# EAGLE design Chasis_2018 (EAGLE 8.5.1)
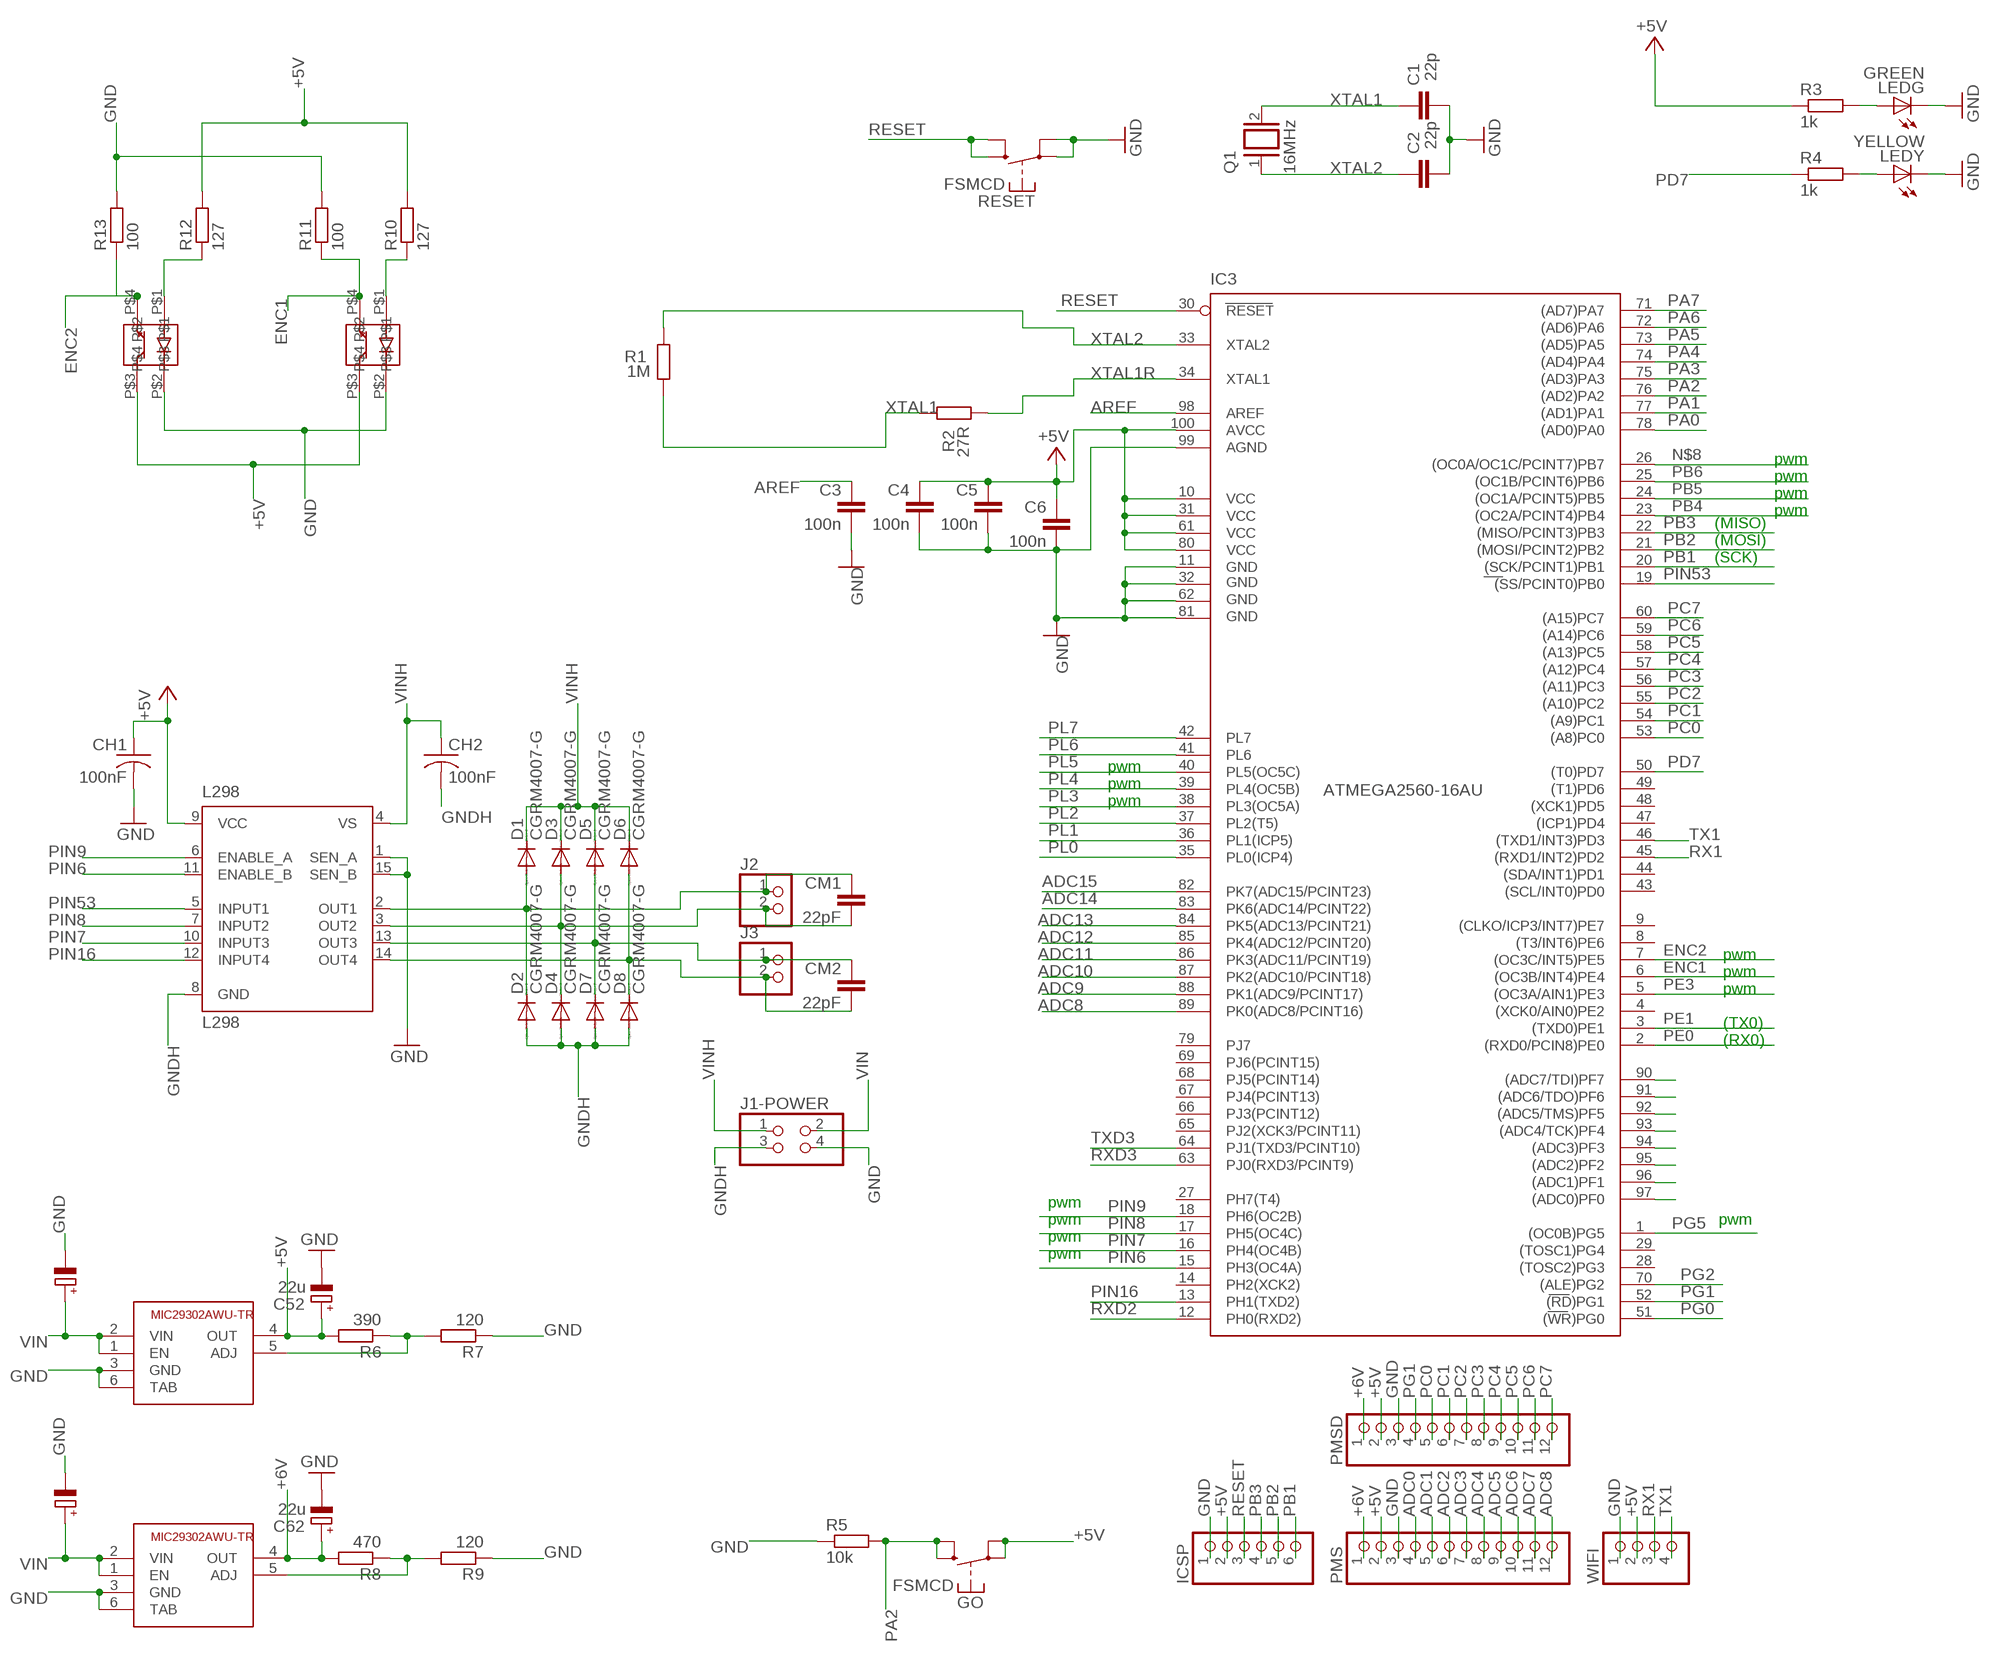
[diagram p0: schematic, sheet 1]

## Parts
C1  22p  C-EUC0805K  [C0805K]
C2  22p  C-EUC0805K  [C0805K]
C3  100n  C-EUC0805K  [C0805K]
C4  100n  C-EUC0805K  [C0805K]
C5  100n  C-EUC0805K  [C0805K]
C6  100n  C-EUC0805K  [C0805K]
C51  10u  CPOL-EUD  [PANASONIC_D]
C52  22u  CPOL-EUD  [PANASONIC_D]
C61  10u  CPOL-EUD  [PANASONIC_D]
C62  22u  CPOL-EUD  [PANASONIC_D]
CH1  100nF  C-USC0805K  [C0805K]
CH2  100nF  C-USC0805K  [C0805K]
CM1  22pF  C-EUC1206K  [C1206K]
CM2  22pF  C-EUC1206K  [C1206K]
D1  CGRM4007-G  [SOD-123_MINI-SMA]
D2  CGRM4007-G  [SOD-123_MINI-SMA]
D3  CGRM4007-G  [SOD-123_MINI-SMA]
D4  CGRM4007-G  [SOD-123_MINI-SMA]
D5  CGRM4007-G  [SOD-123_MINI-SMA]
D6  CGRM4007-G  [SOD-123_MINI-SMA]
D7  CGRM4007-G  [SOD-123_MINI-SMA]
D8  CGRM4007-G  [SOD-123_MINI-SMA]
ENC1  EE-SX1046  [EE-SX1046]
ENC2  EE-SX1046  [EE-SX1046]
GO  FSMCD  [FSMCD]
IC3  ATMEGA2560-16AU  ATMEGA1280-16AU  [TQFP100]
ICSP  PINHD-1X6  [1X06]
J1-POWER  PINHD-2X2  [2X02]
J2  PINHD-1X2  [1X02]
J3  PINHD-1X2  [1X02]
L298  L298  [MULTIWATT-15]
LEDG  GREEN  LEDCHIP-LED0805  [CHIP-LED0805]
LEDY  YELLOW  LEDCHIP-LED0805  [CHIP-LED0805]
PMS  PINHD-1X12  [1X12]
PMSD  PINHD-1X12  [1X12]
Q1  16MHz  XTAL/S  [QS]
R1  1M  R-EU_R0805W  [R0805W]
R2  27R  R-EU_R0805W  [R0805W]
R3  1k  R-EU_R0805W  [R0805W]
R4  1k  R-EU_R0805W  [R0805W]
R5  10k  R-EU_R0805W  [R0805W]
R6  390  R-EU_R0805W  [R0805W]
R7  120  R-EU_R0805W  [R0805W]
R8  470  R-EU_R0805W  [R0805W]
R9  120  R-EU_R0805W  [R0805W]
R10  127  R-EU_R0805W  [R0805W]
R11  100  R-EU_R0805W  [R0805W]
R12  127  R-EU_R0805W  [R0805W]
R13  100  R-EU_R0805W  [R0805W]
REG5V  MIC29302AWU-TR  [TO263-5]
REG6V  MIC29302AWU-TR  [TO263-5]
RESET  FSMCD  [FSMCD]
WIFI  PINHD-1X4  [1X04]

## Nets
+5V: C4.1 C5.1 C6.1 C52.+ CH1.1 ENC1.P$3 ENC2.P$3 GO.P$1(P) GO.P$2(P) IC3.10(VCC) IC3.31(VCC1) IC3.61(VCC2) IC3.80(VCC3) IC3.100(AVCC) ICSP.2 L298.9(VCC) PMS.2 PMSD.2 R3.1 R6.2 R10.2 R12.2 REG5V.4(OUT) WIFI.2
+6V: C62.+ PMS.1 PMSD.1 R8.2 REG6V.4(OUT)
ADC0: IC3.97((ADC0)PF0) PMS.4
ADC1: IC3.96((ADC1)PF1) PMS.5
ADC2: IC3.95((ADC2)PF2) PMS.6
ADC3: IC3.94((ADC3)PF3) PMS.7
ADC4: IC3.93((ADC4/TCK)PF4) PMS.8
ADC5: IC3.92((ADC5/TMS)PF5) PMS.9
ADC6: IC3.91((ADC6/TDO)PF6) PMS.10
ADC7: IC3.90((ADC7/TDI)PF7) PMS.11
ADC8: IC3.89(PK0(ADC8/PCINT16)) PMS.12
ADC9: IC3.88(PK1(ADC9/PCINT17))
ADC10: IC3.87(PK2(ADC10/PCINT18))
ADC11: IC3.86(PK3(ADC11/PCINT19))
ADC12: IC3.85(PK4(ADC12/PCINT20))
ADC13: IC3.84(PK5(ADC13/PCINT21))
ADC14: IC3.83(PK6(ADC14/PCINT22))
ADC15: IC3.82(PK7(ADC15/PCINT23))
AREF: C3.1 IC3.98(AREF)
ENC1: ENC2.P$4 IC3.6((OC3B/INT4)PE4) R11.1
ENC2: ENC1.P$4 IC3.7((OC3C/INT5)PE5) R13.1
GND: C1.1 C2.1 C3.2 C4.2 C5.2 C6.2 C51.- C52.- C61.- C62.- CH1.2 ENC1.P$2 ENC2.P$2 IC3.11(GND) IC3.32(GND1) IC3.62(GND2) IC3.81(GND3) IC3.99(AGND) ICSP.1 J1-POWER.4 L298.1(SEN_A) L298.15(SEN_B) LEDG.C LEDY.C PMS.3 PMSD.3 R5.1 R7.1 R9.1 R11.2 R13.2 REG5V.3(GND) REG5V.6(TAB) REG6V.3(GND) REG6V.6(TAB) RESET.P$1(P) RESET.P$2(P) WIFI.1
GNDH [vcc]: CH2.2 D2.A D4.A D7.A D8.A J1-POWER.3 L298.8(GND)
N$1 [vcc]: CM1.1 D1.A D2.C J2.1 L298.2(OUT1)
N$2: LEDY.A R4.2
N$3: LEDG.A R3.2
N$4 [vcc]: CM1.2 D3.A D4.C J2.2 L298.3(OUT2)
N$5 [vcc]: CM2.2 D6.A D8.C J3.2 L298.14(OUT4)
N$6 [vcc]: CM2.1 D5.A D7.C J3.1 L298.13(OUT3)
N$8: IC3.26((OC0A/OC1C/PCINT7)PB7)
N$9: ENC1.P$1 R12.1
N$11: ENC2.P$1 R10.1
N$12: R6.1 R7.2 REG5V.5(ADJ)
N$17: R8.1 R9.2 REG6V.5(ADJ)
PA0: IC3.78((AD0)PA0)
PA1: IC3.77((AD1)PA1)
PA2: GO.P$3(S) GO.P$4(S) IC3.76((AD2)PA2) R5.2
PA3: IC3.75((AD3)PA3)
PA4: IC3.74((AD4)PA4)
PA5: IC3.73((AD5)PA5)
PA6: IC3.72((AD6)PA6)
PA7: IC3.71((AD7)PA7)
PB1: IC3.20((SCK/PCINT1)PB1) ICSP.6
PB2: IC3.21((MOSI/PCINT2)PB2) ICSP.5
PB3: IC3.22((MISO/PCINT3)PB3) ICSP.4
PB4: IC3.23((OC2A/PCINT4)PB4)
PB5: IC3.24((OC1A/PCINT5)PB5)
PB6: IC3.25((OC1B/PCINT6)PB6)
PC0: IC3.53((A8)PC0) PMSD.5
PC1: IC3.54((A9)PC1) PMSD.6
PC2: IC3.55((A10)PC2) PMSD.7
PC3: IC3.56((A11)PC3) PMSD.8
PC4: IC3.57((A12)PC4) PMSD.9
PC5: IC3.58((A13)PC5) PMSD.10
PC6: IC3.59((A14)PC6) PMSD.11
PC7: IC3.60((A15)PC7) PMSD.12
PD7: IC3.50((T0)PD7) R4.1
PE0: IC3.2((RXD0/PCIN8)PE0)
PE1: IC3.3((TXD0)PE1)
PE3: IC3.5((OC3A/AIN1)PE3)
PG0: IC3.51((WR)PG0)
PG1: IC3.52((RD)PG1) PMSD.4
PG2: IC3.70((ALE)PG2)
PG5: IC3.1((OC0B)PG5)
PIN6: IC3.15(PH3(OC4A)) L298.11(ENABLE_B)
PIN7: IC3.16(PH4(OC4B)) L298.10(INPUT3)
PIN8: IC3.17(PH5(OC4C)) L298.7(INPUT2)
PIN9: IC3.18(PH6(OC2B)) L298.6(ENABLE_A)
PIN16: IC3.13(PH1(TXD2)) L298.12(INPUT4)
PIN53: IC3.19((SS/PCINT0)PB0) L298.5(INPUT1)
PL0: IC3.35(PL0(ICP4))
PL1: IC3.36(PL1(ICP5))
PL2: IC3.37(PL2(T5))
PL3: IC3.38(PL3(OC5A))
PL4: IC3.39(PL4(OC5B))
PL5: IC3.40(PL5(OC5C))
PL6: IC3.41(PL6)
PL7: IC3.42(PL7)
RESET: IC3.30(RESET) ICSP.3 RESET.P$3(S) RESET.P$4(S)
RX1: IC3.45((RXD1/INT2)PD2) WIFI.3
RXD2: IC3.12(PH0(RXD2))
RXD3: IC3.63(PJ0(RXD3/PCINT9))
TX1: IC3.46((TXD1/INT3)PD3) WIFI.4
TXD3: IC3.64(PJ1(TXD3/PCINT10))
VIN: C51.+ C61.+ J1-POWER.2 REG5V.1(EN) REG5V.2(VIN) REG6V.1(EN) REG6V.2(VIN)
VINH [vcc]: CH2.1 D1.C D3.C D5.C D6.C J1-POWER.1 L298.4(VS)
XTAL1: C1.2 Q1.2 R1.1 R2.2
XTAL1R: IC3.34(XTAL1) R2.1
XTAL2: C2.2 IC3.33(XTAL2) Q1.1 R1.2
Unconnected: IC3.4((XCK0/AIN0)PE2) IC3.8((T3/INT6)PE6) IC3.9((CLKO/ICP3/INT7)PE7) IC3.14(PH2(XCK2)) IC3.27(PH7(T4)) IC3.28((TOSC2)PG3) IC3.29((TOSC1)PG4) IC3.43((SCL/INT0)PD0) IC3.44((SDA/INT1)PD1) IC3.47((ICP1)PD4) IC3.48((XCK1)PD5) IC3.49((T1)PD6) IC3.65(PJ2(XCK3/PCINT11)) IC3.66(PJ3(PCINT12)) IC3.67(PJ4(PCINT13)) IC3.68(PJ5(PCINT14)) IC3.69(PJ6(PCINT15)) IC3.79(PJ7)

## Notes on the sheet
- pwm
- pwm
- pwm
- pwm
- (MISO)
- (MOSI)
- (SCK)
- pwm
- pwm
- pwm
- pwm
- pwm
- pwm
- (TX0)
- (RX0)
- pwm
- pwm | pwm
- pwm
- pwm

## Library data of the parts
C1-C6 CM1 CM2 = SmartPrj:C-EU: CAPACITOR, European symbol
C51 C52 C61 C62 = rcl:CPOL-EU: POLARIZED CAPACITOR, European symbol
CH1 CH2 = rcl:C-US: CAPACITOR, American symbol
D1-D8 = diode:CGRM400*-G: Molded plasitc,JEDEC SOD-123/Mini SMA Source: Comchip CGRM4001-G.pdf
ENC1 ENC2 = superEncoder:EE-SX1046
GO RESET = switch-misc:FSMCD: TYCO SWITCH
IC3 = atmel-2005:ATMEGA*: MICROCONTROLLER 64/128/256 Kbytes FLASH 4 Kbytes EEPROM 8 Kbytes SRAM 86 General Purpose I/O pins 12-channels16-bit PWM 4 x Serial USARTs 16-channels 10-bit A/D
ICSP = pinhead:PINHD-1X6: PIN HEADER
J1-POWER = pinhead:PINHD-2X2: PIN HEADER
J2 J3 = pinhead:PINHD-1X2: PIN HEADER
L298 = st-microelectronics:L298: DUAL FULL-BRIDGE DRIVER; MPN: L298N; OC_FARNELL: 1589425; OC_NEWARK: 32M1527
LEDG LEDY = led:LED: LED OSRAM: - CHIPLED LG R971, LG N971, LY N971, LG Q971, LY Q971, LO R971, LY R971 LH N974, LH R974 LS Q976, LO Q976, LY Q976 LO Q996 - Hyper CHIPLED LW Q18S LB Q993, LB Q99A, LB R99A - SideLED LS A670, LO A670, LY A670, LG A670, LP A670 LB A673, LV A673, LT A673, LW A673 LH A674 LY A675 LS A676, LA A676, LO A676, LY A676, LW A676 LS A679, LY A679, LG A679 - Hyper Micro SIDELED® LS Y876, LA Y876, LO Y876, LY Y876 LT Y87S - SmartLED LW L88C, LW L88S LB L89C, LB L89S, LG L890 LS L89K, LO L89K, LY L89K LS L896, LA L896, LO L896, LY L896 - TOPLED LS T670, LO T670, LY T670, LG T670, LP T670 LSG T670, LSP T670, LSY T670, LOP T670, LYG T670 LG T671, LOG T671, LSG T671 LB T673, LV T673, LT T673, LW T673 LH T674 LS T676, LA T676, LO T676, LY T676, LB T676, LH T676, LSB T676, LW T676 LB T67C, LV T67C, LT T67C, LS T67K, LO T67K, LY T67K, LW E67C LS E67B, LA E67B, LO E67B, LY E67B, LB E67C, LV E67C, LT E67C LW T67C LS T679, LY T679, LG T679 LS T770, LO T770, LY T770, LG T770, LP T770 LB T773, LV T773, LT T773, LW T773 LH T774 LS E675, LA E675, LY E675, LS T675 LS T776, LA T776, LO T776, LY T776, LB T776 LHGB T686 LT T68C, LB T68C - Hyper Mini TOPLED® LB M676 - Mini TOPLED Santana® LG M470 LS M47K, LO M47K, LY M47K Source: http://www.osram.convergy.de LUXEON: - LUMILED® LXK2-PW12-R00, LXK2-PW12-S00, LXK2-PW14-U00, LXK2-PW14-V00 LXK2-PM12-R00, LXK2-PM12-S00, LXK2-PM14-U00 LXK2-PE12-Q00, LXK2-PE12-R00, LXK2-PE12-S00, LXK2-PE14-T00, LXK2-PE14-U00 LXK2-PB12-K00, LXK2-PB12-L00, LXK2-PB12-M00, LXK2-PB14-N00, LXK2-PB14-P00, LXK2-PB14-Q00 LXK2-PR12-L00, LXK2-PR12-M00, LXK2-PR14-Q00, LXK2-PR14-R00 LXK2-PD12-Q00, LXK2-PD12-R00, LXK2-PD12-S00 LXK2-PH12-R00, LXK2-PH12-S00 LXK2-PL12-P00, LXK2-PL12-Q00, LXK2-PL12-R00 Source: www.luxeon.com KINGBRIGHT: KA-3528ASYC Source: www.kingbright.com
PMS PMSD = pinhead:PINHD-1X12: PIN HEADER
Q1 = special:XTAL/S: CRYSTAL
R1 R2 = SmartPrj:R-EU_: RESISTOR, European symbol
R3-R13 = resistor:R-EU_: RESISTOR, European symbol
REG5V = MIC29302AWU-TR:MIC29302AWU-TR; AVAILABILITY: Good; DESCRIPTION: MIC29302 Series 16 V 3 A Surface Mount Low Dropout Voltage Regulator - TO-263-5; MF: Microchip; MP: MIC29302AWU-TR; PACKAGE: TO-263-5 Microchip; PRICE: 1.30 USD
REG6V = MIC29302AWU-TR:MIC29302AWU-TR; AVAILABILITY: Good; DESCRIPTION: MIC29302 Series 16 V 3 A Surface Mount Low Dropout Voltage Regulator - TO-263-5; MF: Microchip; MP: MIC29302AWU-TR; PACKAGE: TO-263-5 Microchip; PRICE: 1.30 USD; SPICEPREFIX: X
WIFI = pinhead:PINHD-1X4: PIN HEADER

## Net classes
0 default: width 0.3 mm, drill 0.6 mm, clearance 0.15 mm
1 vcc: width 1.5 mm, drill 0.6 mm, clearance 0.25 mm to class 0

## Board
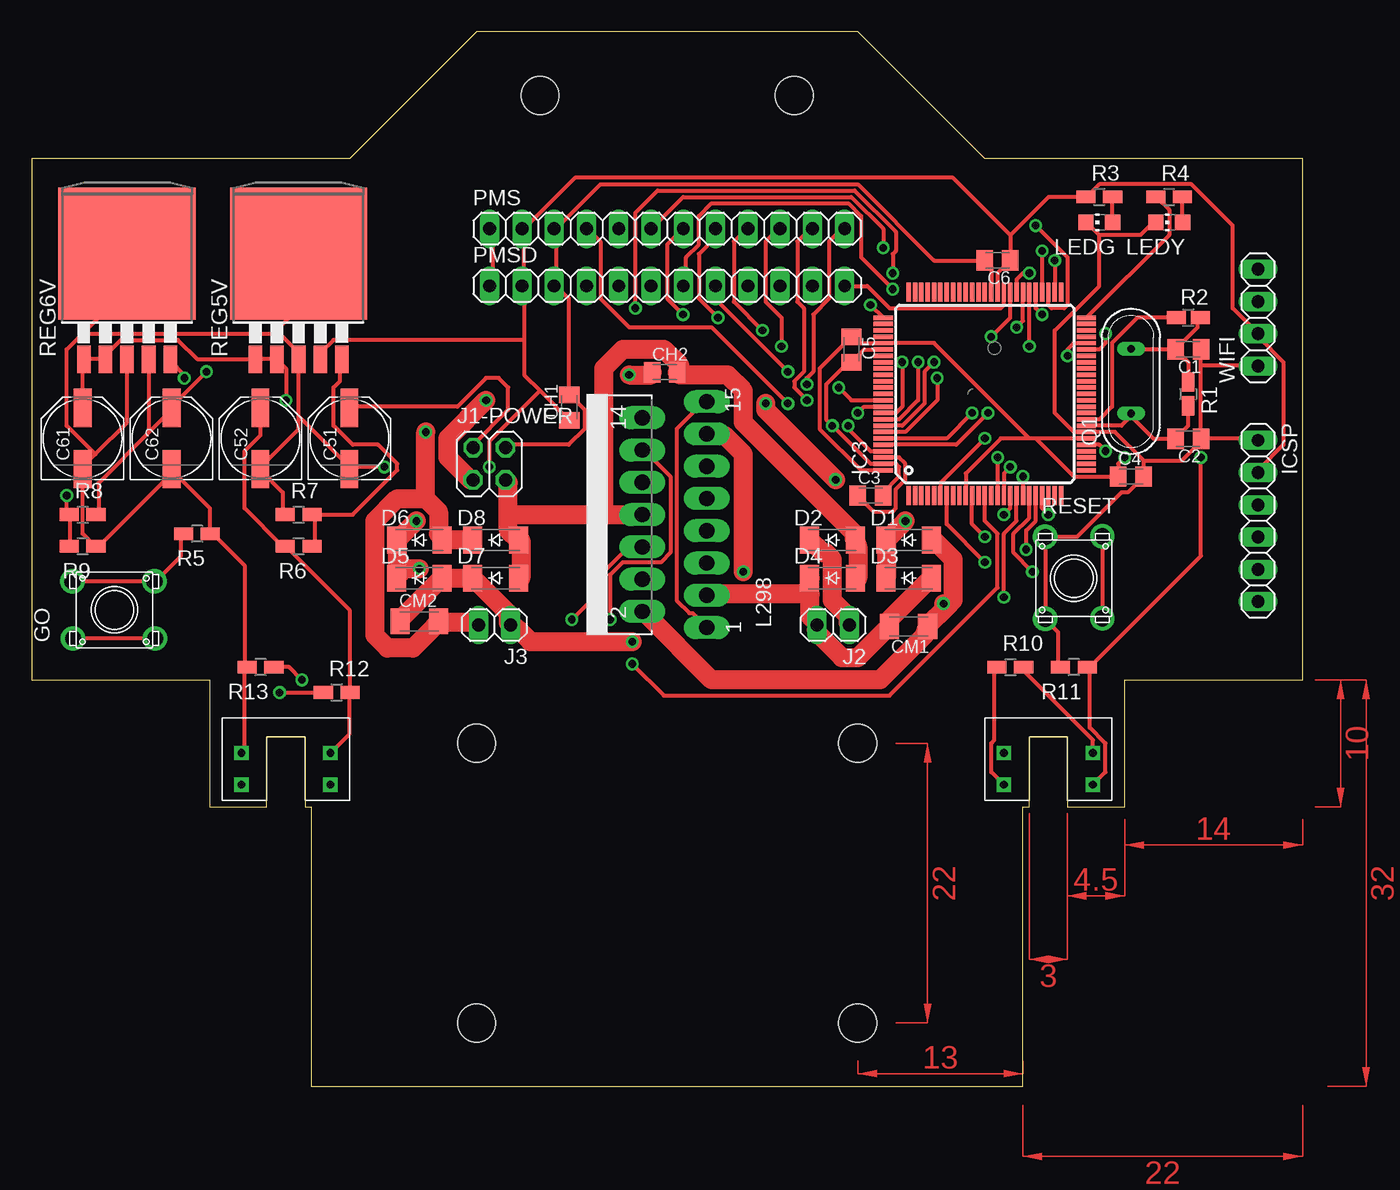
[diagram p1: board, top side]
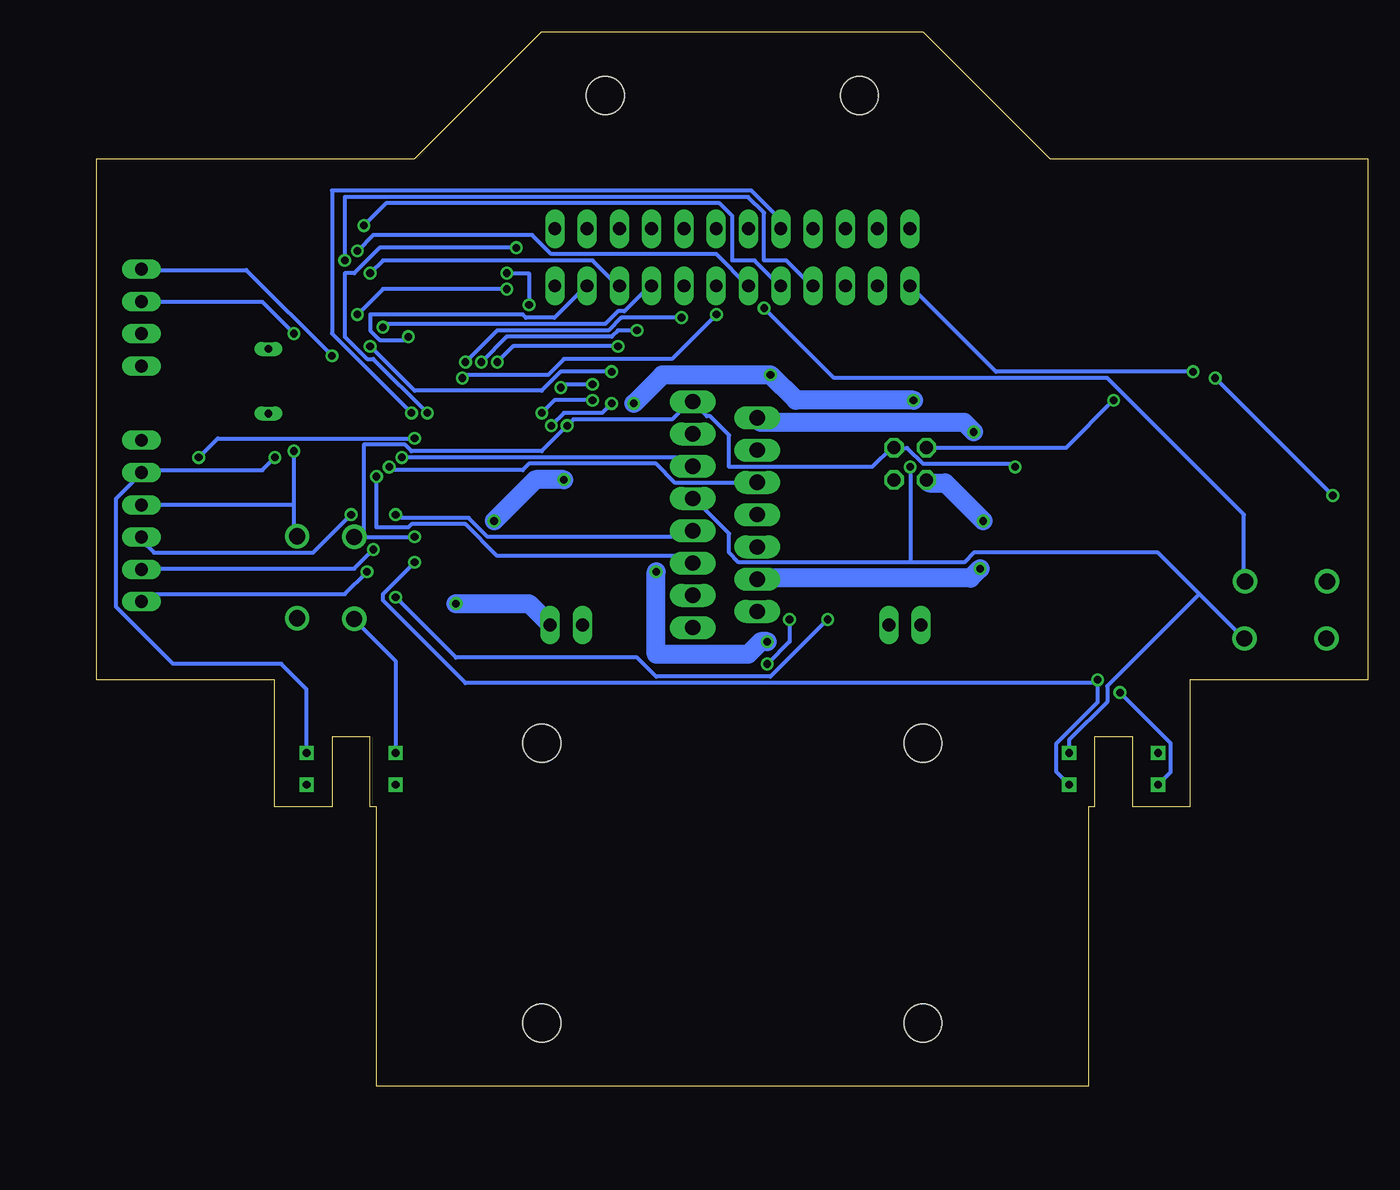
[diagram p2: board, bottom side, seen from below]

Size 100 x 83 mm. Coordinates in mm from the lower left corner, seen from the top.
Outline: 22,0 78,0 78,22 78.5,22 78.5,27.5 81.5,27.5 81.5,22 86,22 86,32 100,32 100,73 75,73 65,83 35,83 25,73 0,73 0,32 14,32 14,22 18.5,22 18.5,27.5 21.5,27.5 21.5,22 22,22 22,0
Copper layers (1*16): Top 0.035mm / dielectric 1.5mm / Bottom 0.035mm
Design rules "default": minimum track width 6mil, minimum drill 0.35mm, track to track 6mil, track to pad 6mil, pad to pad 6mil, via to via 6mil, smd to smd 6mil, copper to edge 40mil, drill to drill 6mil, minimum pad ring 10mil, minimum via ring 8mil, stop-mask expansion 4mil, vias tented up to drill 0mil, thermal gap 10mil
Holes 3 mm at 35,27 35,5 65,27 65,5 40,78 60,78

### Footprints (pad centres in the part's own frame; a part is rotated, then mirrored left to right if it is on the bottom)
C0805K = smd 1.3 x 1.6: 1 -1,0; 2 1,0
PANASONIC_D = smd 3 x 1.4: + 2.4,0; - -2.4,0
C1206K = smd 1.5 x 2: 1 -1.5,0; 2 1.5,0
SOD-123_MINI-SMA = smd 1.5 x 2.1: A 1.8,0; C -1.8,0
EE-SX1046 = drill 0.6 square: P$1 -3.5,-1.25; P$2 -3.5,1.25; P$3 3.5,1.25; P$4 3.5,-1.25
FSMCD = drill 1.27: P$1 -2.25,3.25; P$2 -2.25,-3.2; P$3 2.25,3.3; P$4 2.25,-3.15
TQFP100 = smd 1.5 x 0.35: 1 -8,6; 2 -8,5.5; 3 -8,5; 4 -8,4.5; 5 -8,4; 6 -8,3.5; 7 -8,3; 8 -8,2.5; 9 -8,2; 10 -8,1.5; 11 -8,1; 12 -8,0.5; 13 -8,0; 14 -8,-0.5; 15 -8,-1; 16 -8,-1.5; 17 -8,-2; 18 -8,-2.5; 19 -8,-3; 20 -8,-3.5; 21 -8,-4; 22 -8,-4.5; 23 -8,-5; 24 -8,-5.5; 25 -8,-6; 51 8,-6; 52 8,-5.5; 53 8,-5; 54 8,-4.5; 55 8,-4; 56 8,-3.5; 57 8,-3; 58 8,-2.5; 59 8,-2; 60 8,-1.5; 61 8,-1; 62 8,-0.5; 63 8,0; 64 8,0.5; 65 8,1; 66 8,1.5; 67 8,2; 68 8,2.5; 69 8,3; 70 8,3.5; 71 8,4; 72 8,4.5; 73 8,5; 74 8,5.5; 75 8,6 | smd 0.35 x 1.5: 26 -6,-8; 27 -5.5,-8; 28 -5,-8; 29 -4.5,-8; 30 -4,-8; 31 -3.5,-8; 32 -3,-8; 33 -2.5,-8; 34 -2,-8; 35 -1.5,-8; 36 -1,-8; 37 -0.5,-8; 38 0,-8; 39 0.5,-8; 40 1,-8; 41 1.5,-8; 42 2,-8; 43 2.5,-8; 44 3,-8; 45 3.5,-8; 46 4,-8; 47 4.5,-8; 48 5,-8; 49 5.5,-8; 50 6,-8; 76 6,8; 77 5.5,8; 78 5,8; 79 4.5,8; 80 4,8; 81 3.5,8; 82 3,8; 83 2.5,8; 84 2,8; 85 1.5,8; 86 1,8; 87 0.5,8; 88 0,8; 89 -0.5,8; 90 -1,8; 91 -1.5,8; 92 -2,8; 93 -2.5,8; 94 -3,8; 95 -3.5,8; 96 -4,8; 97 -4.5,8; 98 -5,8; 99 -5.5,8; 100 -6,8
1X06 = drill 1.016 long: 1 -6.35,0; 2 -3.81,0; 3 -1.27,0; 4 1.27,0; 5 3.81,0; 6 6.35,0
2X02 = drill 1.016 octagon: 1 -1.27,-1.27; 2 -1.27,1.27; 3 1.27,-1.27; 4 1.27,1.27
1X02 = drill 1.016 long: 1 -1.27,0; 2 1.27,0
MULTIWATT-15 = drill 1.2 long: 1 -8.89,-7.62; 2 -7.62,-2.54; 3 -6.35,-7.62; 4 -5.08,-2.54; 5 -3.81,-7.62; 6 -2.54,-2.54; 7 -1.27,-7.62; 8 0,-2.54; 9 1.27,-7.62; 10 2.54,-2.54; 11 3.81,-7.62; 12 5.08,-2.54; 13 6.35,-7.62; 14 7.62,-2.54; 15 8.89,-7.62
CHIP-LED0805 = smd 1.2 x 1.2: A 0,-1.05; C 0,1.05
1X12 = drill 1.016 long: 1 -13.97,0; 2 -11.43,0; 3 -8.89,0; 4 -6.35,0; 5 -3.81,0; 6 -1.27,0; 7 1.27,0; 8 3.81,0; 9 6.35,0; 10 8.89,0; 11 11.43,0; 12 13.97,0
QS = drill 0.61 long: 1 -2.54,0; 2 2.54,0
R0805W = smd 1.5 x 1: 1 -0.94,0; 2 0.94,0
R0805W' = smd 1.5 x 1: 1 -1.052,0; 2 1.052,0
TO263-5 = smd 1.067 x 2.159: 1 -3.404,-5.791; 2 -1.702,-5.791; 3 0,-5.791; 4 1.702,-5.791; 5 3.404,-5.791 | smd 10.8 x 10.41: 6 0,2.54
1X04 = drill 1.016 long: 1 -3.81,0; 2 -1.27,0; 3 1.27,0; 4 3.81,0

### Placement (x,y rotation side)
C1  91,58 180 top
C2  91,50.97 180 top
C3  66,46.5 0 top
C4  86.5,48 0 top
C5  64.5,58 270 top
C6  76,65 180 top
C51  25,51 90 top
C52  18,51 90 top
C61  4,51 90 top
C62  11,51 90 top
CH1  42.29,53.43 90 top
CH2  49.81,56.21 0 top
CM1  69,36.2 180 top
CM2  30.5,36.6 0 top
D1  69,43 0 top
D2  63,43 0 top
D3  69,40 0 top
D4  63,40 0 top
D5  30.5,40 0 top
D6  30.5,43 0 top
D7  36.5,40 0 top
D8  36.5,43 0 top
ENC1  20,25 0 top
ENC2  80,25 0 top
GO  6.5,37.5 90 top
IC3  75,54.5 90 top
ICSP  96.5,44.5 270 top
J1-POWER  36,49 0 top
J2  63.07,36.32 180 top
J3  36.42,36.32 180 top
L298  45.5,45 90 top
LEDG  84,68 90 top
LEDY  89.5,68 90 top
PMS  50,67.5 0 top
PMSD  50,63 0 top
Q1  86.5,55.5 90 top
R1  91,54.5 270 top
R2  91,60.5 0 top
R3  1k  [R0805W']  84,70 0 top
R4  1k  [R0805W']  89.5,70 0 top
R5  10k  [R0805W']  13,43.5 180 top
R6  390  [R0805W']  21,42.5 180 top
R7  120  [R0805W']  21,45 0 top
R8  470  [R0805W']  4,45 0 top
R9  120  [R0805W']  4,42.5 180 top
R10  127  [R0805W']  77,33 0 top
R11  100  [R0805W']  82,33 180 top
R12  127  [R0805W']  24,31 0 top
R13  100  [R0805W']  18,33 180 top
REG5V  21,63 0 top
REG6V  7.5,63 0 top
RESET  82,40 0 top
WIFI  96.5,60.5 90 top

### Tracks (layer width: path | path; a pad name or v marks a point on that pad's centre or on a via)
+5V  (via drill 0.6)
  Top 0.3: C52.+ 18,51.25 16.75,50 16.75,45.5 19.75,42.5 R6.2 20,42.5 25,37.5 25,31 | GO.P$2 GO.P$1 | IC3.100 65.25,48.5 62,51.75 62,56.5 64,58.5 | 64,58.5 IC3.80 71,58.5 78.5,51 | 64,58.5 C5.1 | IC3.10 73.5,48.25 76.25,51 78.5,51 | IC3.31 79,51 | 79,51 78.5,51 | 79,51 82,48 C4.1 85.5,49 v86,49.5 | IC3.61 76,64 C6.1 77,67 | ICSP.2 96.5,48.5 98.5,50.5 98.5,57 96.5,59 WIFI.2 96.5,59.25 94.5,61.25 94.5,67.75 91.25,71 84,71 83,70 R3.1 80,70 77,67 | 25,31 25,27.75 ENC1.P$3 | 25,31 R12.2 | 40,54.75 38.75,56 38.75,58.75 | 40,54.75 42.25,52.5 CH1.1 | 38.75,63 38.75,58.75 | 38.75,58.75 23.75,58.75 22.75,57.75 22.75,57.25 REG5V.4 | 38.75,63 38.75,67.5 | 38.75,63 PMSD.2 | ENC2.P$3 83.5,27.25 78.25,32.5 78.25,33 R10.2 | 38.75,67.5 42.75,71.5 72.5,71.5 77,67 | 38.75,67.5 PMS.2 | v36,48.75 36,50.75 40,54.75
  Bottom 0.3: v86,49.5 87,48.5 96.5,48.5 ICSP.2 96.5,48.25 98.5,46.25 98.5,37.75 94,33.25 85.5,33.25 83.5,31.25 ENC2.P$3 | 36,41.25 31.75,41.25 31,42 16.5,42 13.25,38.75 | 36,41.25 49.5,41.25 50.25,42 50.25,43.5 53,46.25 L298.9 | 13.25,38.75 9.75,35.25 GO.P$2 | ENC1.P$3 23.5,27.25 20.5,30.25 20.5,31.5 13.25,38.75 | v36,48.75 36,41.25
+6V  (via drill 0.6)
  Top 0.3: PMSD.1 36.25,63 36.25,67.5 PMS.1 | 9.25,51.5 11,53.25 C62.+ 11,53.5 v13.75,56.25 | 9.25,51.5 5.25,47.5 5.25,45 R8.2 | 9.25,51.5 9.25,57 REG6V.4
  Bottom 0.3: v13.75,56.25 29.25,56.25 36,63 PMSD.1
ADC0  (via drill 0.6)
  Top 0.3: IC3.97 66,50 64.25,51.75 v64.25,52 | v59.5,53.75 53.5,59.75 47,59.75 44.75,62 44.75,66.5 43.75,67.5 PMS.4
  Bottom 0.3: v64.25,52 63.25,53 60.25,53 v59.5,53.75
ADC1  (via drill 0.6)
  Top 0.3: IC3.96 72.75,50.5 v75.25,53
  Bottom 0.3: v75.25,53 81.5,59.25 81.5,70.5 48.5,70.5 46.25,68.25 46.25,67.5 PMS.5
ADC2  (via drill 0.6)
  Top 0.3: IC3.95 72,51 v74,53 | v67,66 67,67.5 64.5,70 51.25,70 48.75,67.5 PMS.6
  Bottom 0.3: v74,53 78.25,57.25 78.75,57.25 80.5,59 80.5,64 79.75,64 77.75,66 v67,66
ADC3  (via drill 0.6)
  Top 0.3: IC3.94 68.75,51.5 71.25,54 v71.25,55.75 | v51.25,60.75 50,62 50,66.25 51.25,67.5 PMS.7
  Bottom 0.3: v71.25,55.75 71,56 64.5,56 63.25,57.25 54.75,57.25 v51.25,60.75
ADC4  (via drill 0.6)
  Top 0.3: IC3.93 68.5,52 70.25,53.75 70.25,56.25 v71,57 | v54,60.5 52.5,62 52.5,65.5 53.75,66.75 53.75,67.5 PMS.8
  Bottom 0.3: v71,57 68.5,59.5 59.75,59.5 58.75,60.5 v54,60.5
ADC5  (via drill 0.6)
  Top 0.3: IC3.92 68.25,52.5 69.75,54 v69.75,57 | v57.5,59.5 55.25,61.75 55.25,66.5 56.25,67.5 PMS.9
  Bottom 0.3: v69.75,57 67.75,59 59.5,59 59,59.5 v57.5,59.5
ADC6  (via drill 0.6)
  Top 0.3: IC3.91 68,53 68.5,53.5 v68.5,57 | v59,58.25 59,60.5 57.75,61.75 57.75,66.5 58.75,67.5 PMS.10
  Bottom 0.3: v68.5,57 67.25,58.25 v59,58.25
ADC7  (via drill 0.6)
  Top 0.3: IC3.90 65.5,53.5 v65,53 | v61,54 60,55 60,55.5 60.75,56.25 60.75,61.25 60.25,61.75 60.25,66.5 61.25,67.5 PMS.11
  Bottom 0.3: v65,53 64,54 v61,54
ADC8  (via drill 0.6)
  Top 0.3: IC3.89 64.5,54 v63.5,55 | v61,55.25 61,55.75 61.5,56.25 61.5,60.75 62.75,62 62.75,66.5 63.75,67.5 PMS.12
  Bottom 0.3: v63.5,55 63.25,55.25 v61,55.25
AREF
  Top 0.3: IC3.98 68.25,49.5 68.75,49 68.75,47.75 68,47 68,45.5 67.75,45.25 66.25,45.25 C3.1
ENC1  (via drill 0.6)
  Top 0.3: 83.25,33 83.25,28.25 84.5,27 84.5,24.75 ENC2.P$4 | IC3.6 71.5,47.5 v75,51 | v92,49.5 92,41.75 83.25,33 | 83.25,33 R11.1
  Bottom 0.3: v75,51 90.5,51 v92,49.5
ENC2  (via drill 0.6)
  Top 0.3: R13.1 20.25,33 v21.25,32 | IC3.7 72,44.25 v75,41.25
  Bottom 0.3: 21.25,31.75 21.25,30.25 24.5,27 24.5,24.75 ENC1.P$4 | v75,41.25 77.5,38.75 77.5,38.25 71,31.75 21.25,31.75 | 21.25,31.75 v21.25,32
GND  (via drill 0.6)
  Top 0.3: IC3.11 74,44.25 v75,43.25 | 92,51 96.5,51 ICSP.1 | 92,51 92,56.75 | 92,56.75 C1.1 | 92,51 C2.1 92,50.75 90.5,49.25 87.5,49.25 | 92,56.75 96.5,56.75 WIFI.1 | 84,67 83,68 LEDG.C | 84,67 87.25,67 88.25,68 LEDY.C | 87.5,49.25 85.25,51.5 IC3.32 82,51.5 80.5,53 80.5,59.5 84,63 84,67 | 87.5,49.25 C4.2 86.25,46.75 85.75,46.75 82.25,43.25 RESET.P$1 RESET.P$2 79.75,36.75 80.75,35.75 80.75,33 R11.2 | R7.1 19.75,45 19.75,46.75 18,48.5 C52.- 18,48.75 21,51.75 21,52.75 | 21,52.75 REG5V.3 21,57.75 19.5,59.25 19,59.25 | 21,52.75 25,48.75 | REG6V.3 7.5,52.25 5,49.75 | 5,49.75 4,48.75 C61.- 4,43.5 5,42.5 R9.1 5.25,42.5 11,48.25 11,48.5 | 4,59.25 19,59.25 | 4,59.25 2.75,58 2.75,52 5,49.75 | C3.2 67,46.75 68.25,48 68.25,48.75 68,49 IC3.99 66,49 v63,52 62.5,52.5 62.5,55.25 64.25,57 C5.2 65.5,58 IC3.81 | L298.1 53,36.25 52,37.25 51.75,37.25 50.75,38.25 50.75,51.75 53,54 L298.15 | 41.25,63 42.25,62 42.25,54.5 CH1.2 42.5,54.25 43.5,53.25 43.5,51.75 42.25,50.5 37.5,50.5 J1-POWER.4 | IC3.62 75.5,64.5 C6.2 71,65 65,71 44.75,71 41.25,67.5 | 41.25,67.5 41.25,63 | 41.25,63 PMSD.3 | 41.25,67.5 PMS.3 | v27.75,48.75 25,48.75 | 25,48.75 C51.- | REG6V.6 7.5,62.75 4,59.25 | REG5V.6 21,61.25 19,59.25 | 16.75,33 16.75,26.5 ENC1.P$2 | 11,48.5 14,45.5 14,43.5 R5.1 14.25,43.5 16.75,41 16.75,33 | 16.75,33 R13.2 | 11,48.5 C62.-
  Bottom 0.3: 79,43.25 v75,43.25 | v27.75,48.75 28,49 35,49 36.25,50.25 37.25,50.25 J1-POWER.4 37.5,50.25 39,48.75 50.25,48.75 50.25,51.25 51.75,52.75 52,52.75 53,53.75 L298.15 53.25,53.75 53.5,53.75 54.75,52.5 62.5,52.5 v63,52 65,50 75.25,50 75.75,50.5 79,50.5 79,43.25 | 79,43.25 RESET.P$1 | ENC2.P$2 76.5,33.5 79.75,36.75 RESET.P$2
GNDH
  Top 1.5: D7.A 38.5,40 38.5,43 D8.A 37.75,43.5 37.5,43.75 37.5,45 | 37.5,45 37.5,47.5 J1-POWER.3 | 37.5,45 45,45 | 45,45 L298.8 | D4.A 65,40 65,42.5 D2.A 64.75,43 64.75,43.5 56,52.25 56,54.75 54.75,56 51,56 CH2.2 51,56.75 49.75,58 46.5,58 45,56.5 45,45
N$1  (via drill 0.6)
  Top 1.5: D2.C 61.25,43 62.25,42 62.5,42 63,41.5 63,38.25 64.25,37 64.25,36.5 J2.1 | 72,37.75 72.5,38.25 72.5,41.5 71,43 D1.A | 72,37.75 70.5,36.25 CM1.1 70.25,35.5 66.75,32 53.5,32 48.25,37.25 L298.2 | v71.75,38 72,37.75
  Bottom 1.5: v71.75,38 66,38 64.5,36.5 J2.1
N$2
  Top 0.3: LEDY.A 90.5,68 90.5,70 R4.2
N$3
  Top 0.3: LEDG.A 85,68 85,70 R3.2
N$4
  Top 1.5: D3.A 70.75,40 67.5,36.75 CM1.2 67,35.75 65,33.75 63.75,33.75 61.75,35.75 J2.2 61.75,36.5 61.25,37 61.25,38.75 | 61.25,38.75 61.25,40 D4.C | 61.25,38.75 53.25,38.75 L298.3
N$5  (via drill 0.6)
  Top 1.5: D8.C D6.A 32,43.5 32,45.25 31,46.25 | J3.2 35,36.5 32,36.5 CM2.2 31.5,36 30,34.5 28,34.5 27,35.5 27,44.5 28.75,46.25 31,46.25 | 31,46.25 v31,51.5
  Bottom 1.5: v31,51.5 31.75,52.25 47.75,52.25 48,52.5 L298.14
N$6  (via drill 0.6)
  Top 1.5: CM2.1 29,36.75 32.25,40 D5.A D7.C 35.25,39.5 37.5,37.25 37.5,36.5 J3.1 38.25,36 39.25,35 v47.25,35 | v56,40.5 56,49.75 54.5,51.25 53.25,51.25 L298.13
  Bottom 1.5: v56,40.5 56,34 48.75,34 47.75,35 v47.25,35
N$9  (via drill 0.6)
  Top 0.3: v19.5,31 R12.1
  Bottom 0.3: v19.5,31 15.5,27 15.5,24.75 ENC1.P$1
N$11
  Top 0.3: ENC2.P$1 75.5,24.75 75.5,27 75.75,27.25 75.75,33 R10.1
N$12
  Top 0.3: 22.25,45 22.25,42.5 R6.1 | 22.25,45 25.25,45 28.75,48.5 28.75,49 27.25,50.5 25.25,50.5 23.75,52 23.75,55 24.25,55.5 24.25,57 REG5V.5 | 22.25,45 R7.2
N$17  (via drill 0.6)
  Top 0.3: R9.2 3,42.5 3,45 R8.1 2.75,45 v2.75,46.5 | v12,55.75 12,56 11,57 REG6V.5
  Bottom 0.3: v2.75,46.5 v12,55.75
PA2  (via drill 0.6)
  Top 0.3: R5.2 11.75,43.5 11.75,41.75 9.75,39.75 GO.P$4 GO.P$3 | v66,61.5 IC3.76 | v67.75,64 67.75,65.5 68,65.75 68,67.25 64.75,70.5 49.25,70.5 47.5,68.75 v47.5,61.25
  Bottom 0.3: v66,61.5 66,64 v67.75,64 | v47.5,61.25 42,55.75 20.5,55.75 9.75,45 9.75,39.75 GO.P$4
PB1  (via drill 0.6)
  Top 0.3: IC3.20 78.5,44.75 77.25,43.5 77.25,42 v78.75,40.5
  Bottom 0.3: v78.75,40.5 80.5,38.75 96,38.75 96.5,38.25 ICSP.6
PB2  (via drill 0.6)
  Top 0.3: IC3.21 79,44.5 78.25,43.75 v78.25,42.25
  Bottom 0.3: v78.25,42.25 79.75,40.75 96.5,40.75 ICSP.5
PB3  (via drill 0.6)
  Top 0.3: IC3.22 79.5,45.5 v80,45
  Bottom 0.3: v80,45 83,42 95.5,42 96.5,43 ICSP.4
PC0  (via drill 0.6)
  Top 0.3: IC3.53 80,61.5 80.25,61.25 81.25,61.25 81.5,61.5 81.5,65.25 v79,67.75
  Bottom 0.3: v79,67.75 77.25,69.5 51,69.5 50,68.5 50,65 48.25,65 46.25,63 PMSD.5
PC1  (via drill 0.6)
  Top 0.3: v79.5,65.75 IC3.54
  Bottom 0.3: v79.5,65.75 78.25,67 65.75,67 64.25,65.5 51.25,65.5 48.75,63 PMSD.6
PC2  (via drill 0.6)
  Top 0.3: IC3.55 79,61.25 v79.5,60.75 | v67.75,62.75 65.25,65.25 65.25,68.5 64.25,69.5 53.5,69.5 52.5,68.5 52.5,66.25 51.5,65.25 51.5,63 PMSD.7
  Bottom 0.3: v79.5,60.75 77.5,62.75 v67.75,62.75
PC3  (via drill 0.6)
  Top 0.3: v78.5,58.25 IC3.56 | v59.5,56.25 54,61.75 54,63 PMSD.8
  Bottom 0.3: v78.5,58.25 75,54.75 65,54.75 63.5,56.25 v59.5,56.25
PC4  (via drill 0.6)
  Top 0.3: IC3.57 78,60.25 v77.5,59.75
  Bottom 0.3: v77.5,59.75 77.25,60 60,60 59,61 58.5,61 56.5,63 PMSD.9
PC5  (via drill 0.6)
  Top 0.3: IC3.58 77.5,63.5 78,64 v78.5,64
  Bottom 0.3: v78.5,64 77.5,65 61,65 59,63 PMSD.10
PC6  (via drill 0.6)
  Top 0.3: IC3.59 77,60.5 v75.5,59
  Bottom 0.3: v75.5,59 75.75,58.75 77.75,58.75 78.5,59.5 78.5,60.75 66.5,60.75 66.25,60.5 64,60.5 61.5,63 PMSD.11
PC7
  Top 0.3: IC3.60 76.5,61.5 76.25,61.25 67.5,61.25 65.75,63 PMSD.12
PD7
  Top 0.3: IC3.50 89.5,67 89.5,69 88.5,70 R4.1
PG1  (via drill 0.6)
  Top 0.3: v80.5,65 IC3.52
  Bottom 0.3: v80.5,65 80.5,70 48.75,70 47.5,68.75 47.5,65 45.75,65 43.75,63 PMSD.4
PIN6  (via drill 0.6)
  Top 0.3: v76,49.5 IC3.15
  Bottom 0.3: v76,49.5 53.75,49.5 53.25,49 L298.11
PIN7  (via drill 0.6)
  Top 0.3: IC3.16 76.5,48.25 v77,48.75
  Bottom 0.3: v77,48.75 76.75,48.5 66.5,48.5 66,49 56,49 54.5,47.5 48.25,47.5 L298.10
PIN8  (via drill 0.6)
  Top 0.3: IC3.17 77,45.5 v76.5,45
  Bottom 0.3: v76.5,45 76.25,44.75 70.75,44.75 69.25,43.25 53.5,43.25 53.25,43.5 L298.7
PIN9  (via drill 0.6)
  Top 0.3: IC3.18 77.5,44.5 76.5,43.5 v76.5,38.5 | v42.5,36.75 45,39.25 45,40.5 46.75,42.25 48,42.25 L298.6
  Bottom 0.3: v76.5,38.5 71.75,33.75 57.5,33.75 56,32.25 47,32.25 v42.5,36.75
PIN16  (via drill 0.6)
  Top 0.3: IC3.13 75,44.5 76,43.5 76,39.25 67.5,30.75 49.75,30.75 v47.25,33.25 | v45.5,36.75 45.5,40.25 46.5,41.25 49.5,41.25 50.25,42 50.25,48 48.25,50 L298.12
  Bottom 0.3: v47.25,33.25 45.5,35 v45.5,36.75
PIN53  (via drill 0.6)
  Top 0.3: v78,48 IC3.19
  Bottom 0.3: v78,48 78,44 75.5,44 75.25,44.25 71,44.25 68.5,41.75 53.75,41.75 53.25,41.25 L298.5
RESET  (via drill 0.6)
  Top 0.3: IC3.30 84,50.5 v84.5,50 | RESET.P$3 RESET.P$4
  Bottom 0.3: 84.5,45.75 84.5,43.5 84.25,43.5 RESET.P$3 | 84.5,45.75 v84.5,50 | 84.5,45.75 96.5,45.75 ICSP.3
RX1  (via drill 0.6)
  Top 0.3: IC3.45 84,58 84.5,58.5 v84.5,59.25
  Bottom 0.3: v84.5,59.25 87,61.75 96.5,61.75 WIFI.3
TX1  (via drill 0.6)
  Top 0.3: IC3.46 82,58.5 81.5,58 v81.5,57.5
  Bottom 0.3: v81.5,57.5 88.25,64.25 96.5,64.25 WIFI.4
VIN  (via drill 0.6)
  Top 0.3: C51.+ 25,53.5 33.5,53.5 35.75,55.75 36.75,55.75 37.5,55 37.5,53.25 34.75,50.5 J1-POWER.2 | 5.5,57.25 5.75,57.25 REG6V.2 5.5,57.25 | 5.5,57.25 4.25,57.25 REG6V.1 4,57 C61.+ | 5.5,57.25 7,58.75 11.5,58.75 13,57.25 17.5,57.25 REG5V.1 17.75,57.25 19.25,57.25 REG5V.2 19.5,57 20,56.5 v20,54
  Bottom 0.3: v20,54 23.75,50.25 34.5,50.25 J1-POWER.2
VINH  (via drill 0.6)
  Top 1.5: D3.C 67.25,40 67.25,43 D1.C 67.75,43.5 v68.75,44.5 | v47,56 48.75,56 CH2.1 | v35.75,54 32.75,51 32.75,49.5 34.5,47.75 J1-POWER.1 | v30.25,44.5 29.25,43.5 D6.C 28.75,43 28.75,40 D5.C 29.25,40.75 v30.5,40.75 | v63.25,47.75 57.75,53.25 v57.75,53.75
  Bottom 1.5: v35.75,54 45,54 v47,56 55.5,56 v57.75,53.75 | v30.25,44.5 33.25,47.5 34.5,47.5 J1-POWER.1 | v68.75,44.5 65.5,47.75 v63.25,47.75 | v30.5,40.75 31.25,40 48,40 L298.4
XTAL1
  Top 0.3: R1.1 91,57 C1.2 | C1.2 91.75,59.75 91.75,60.5 R2.2 | C1.2 86.5,58 Q1.2
XTAL1R
  Top 0.3: IC3.34 84,52.5 85,53.5 85,58.5 87,60.5 R2.1
XTAL2
  Top 0.3: R1.2 91,52 90,51 | IC3.33 85.75,52 86.5,52.75 | 90,51 88.25,51 86.5,52.75 | 90,51 C2.2 | 86.5,52.75 Q1.1
(copper drawn outside any net)
  shapes: Top area x8